# EAGLE design RasPi-BplusHAT (EAGLE 9.2.2)
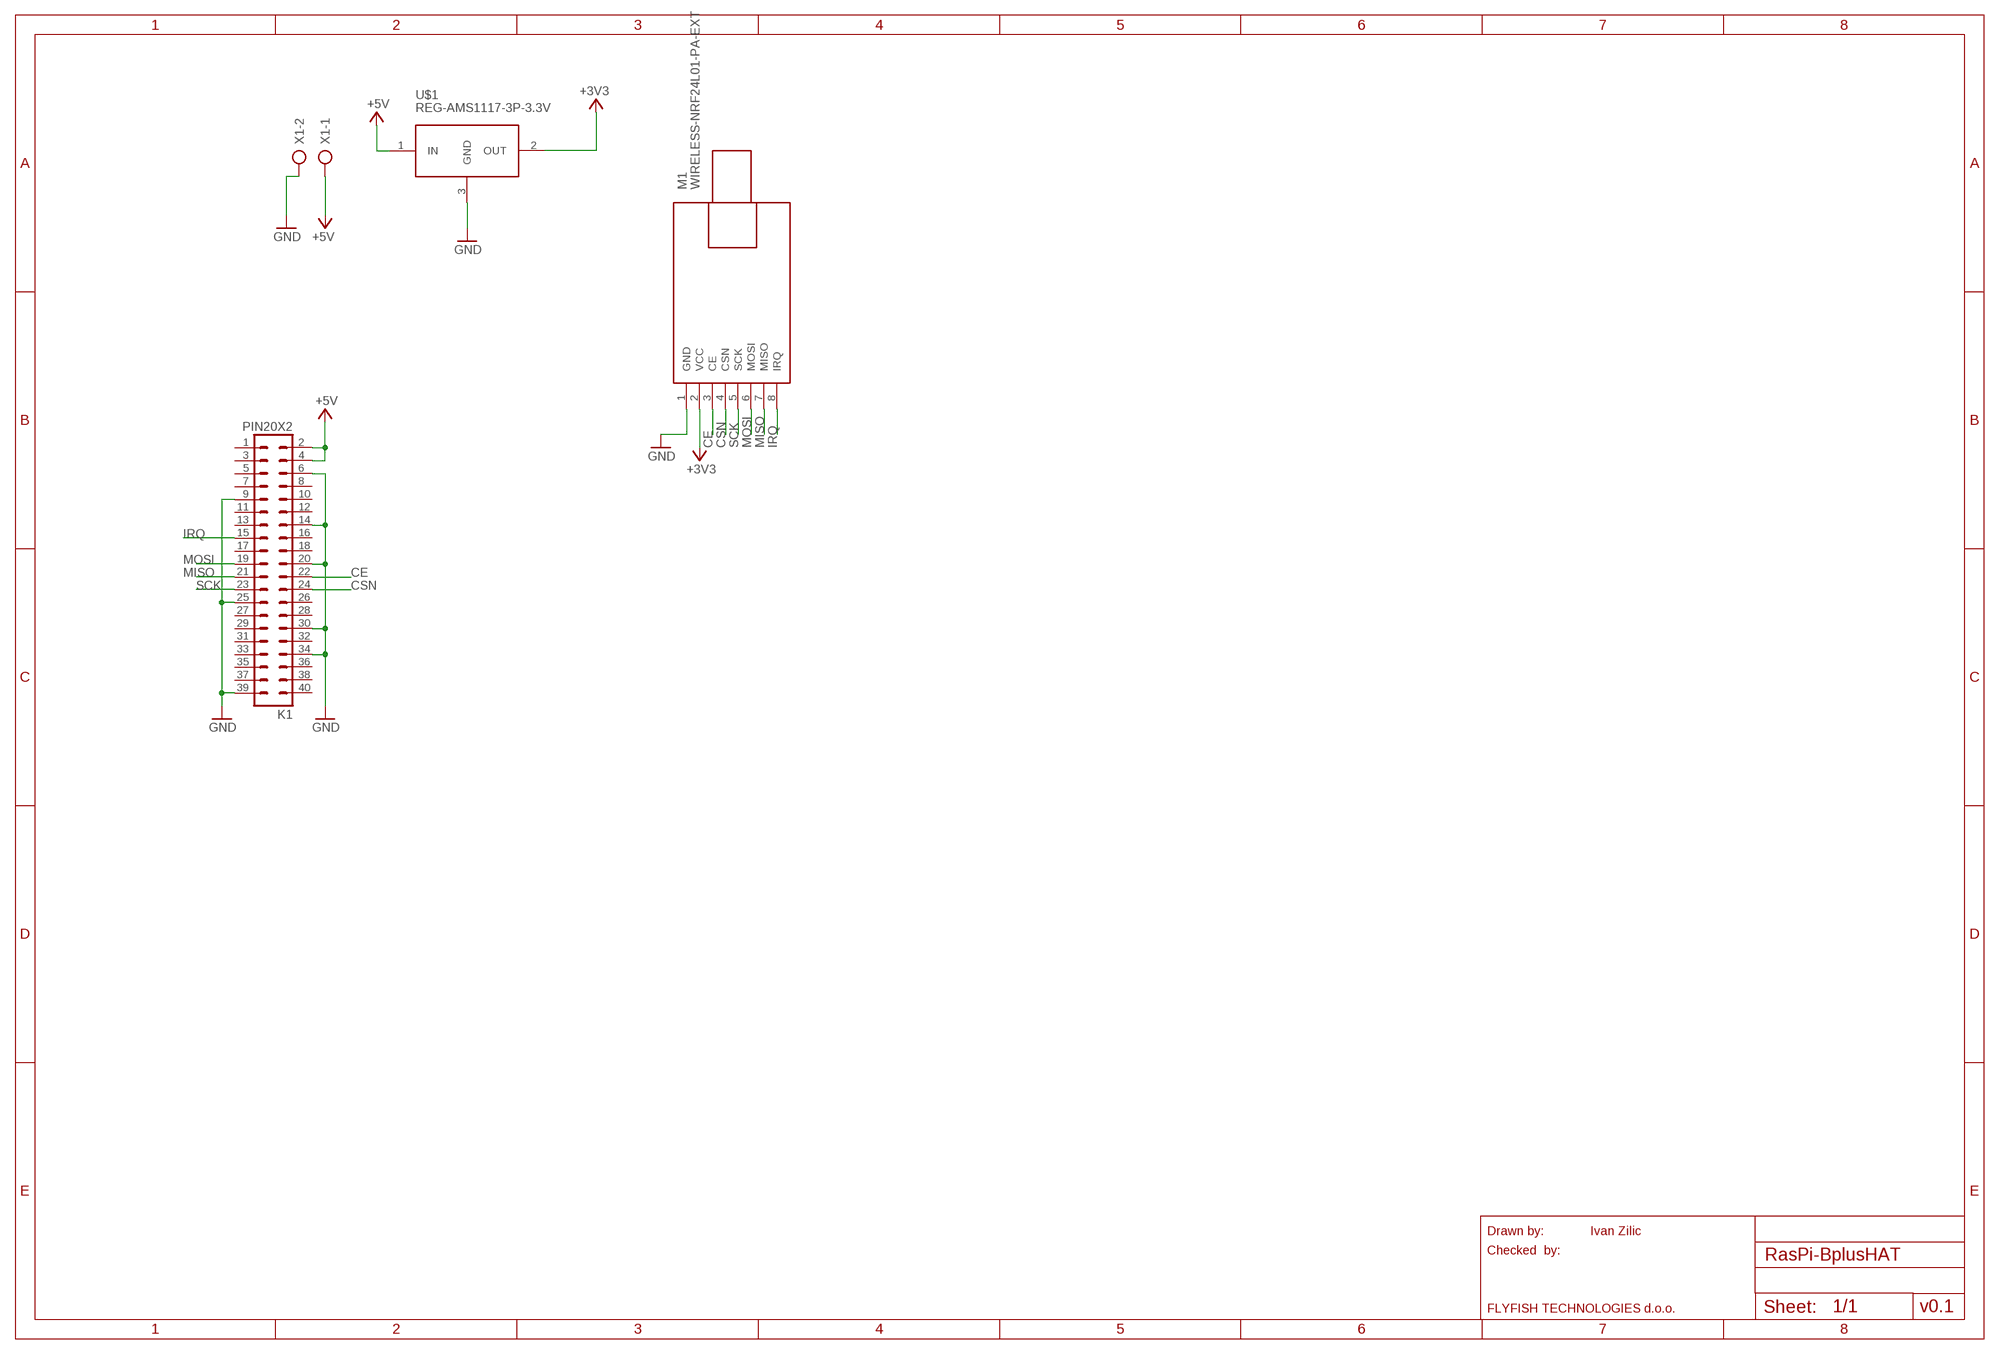
[diagram p0: schematic, sheet 1]

## Parts
K1  PIN20X2  [PIN_20X2]
M1  WIRELESS-NRF24L01-PA-EXT  [WIRELESS-NRF24L01-PA-EXT]
U$1  REG-AMS1117-3P-3.3V  [REG-AMS1117-3P]
X1  AK500/2  [AK500/2]

## Nets
+3V3: M1.2(VCC) U$1.2(OUT)
+5V: K1.2 K1.4 U$1.1(IN) X1.1
CE: K1.22 M1.3(CE)
CSN: K1.24 M1.4(CSN)
GND: K1.6 K1.9 K1.14 K1.20 K1.25 K1.30 K1.34 K1.39 M1.1(GND) U$1.3(GND) X1.2
IRQ: K1.15 M1.8(IRQ)
MISO: K1.21 M1.7(MISO)
MOSI: K1.19 M1.6(MOSI)
SCK: K1.23 M1.5(SCK)
Unconnected: K1.1 K1.3 K1.5 K1.7 K1.8 K1.10 K1.11 K1.12 K1.13 K1.16 K1.17 K1.18 K1.26 K1.27 K1.28 K1.29 K1.31 K1.32 K1.33 K1.35 K1.36 K1.37 K1.38 K1.40

## Notes on the sheet
- Drawn by: | Ivan Zilic
- Checked  by:
- FLYFISH TECHNOLOGIES d.o.o. | v0.1

## Library data of the parts
K1 = FLYFISH:PIN20X2
M1 = diy-modules (1):WIRELESS-NRF24L01-PA-EXT: 2.4 GHz Wireless Module based on NRF24L01 chip with preamplifier and external antenna Click here to find device on ebay.com <http://www.ebay.com/sch/nrf24l01+pa+lna+sma>
U$1 = diy-modules:REG-AMS1117-3P-*: Linear Regulator based on AMS1117 chip 3-pin version AMS1117 datasheet is available here: http://www.advanced-monolithic.com/pdf/ds1117.pdf Click here to find device on ebay.com <http://www.ebay.com/sch/ams1117+module> Note: There are many variants. Search for the proper version.
X1 = con-ptr500:AK500/2: CONNECTOR; OC_FARNELL: unknown; OC_NEWARK: unknown

## Board
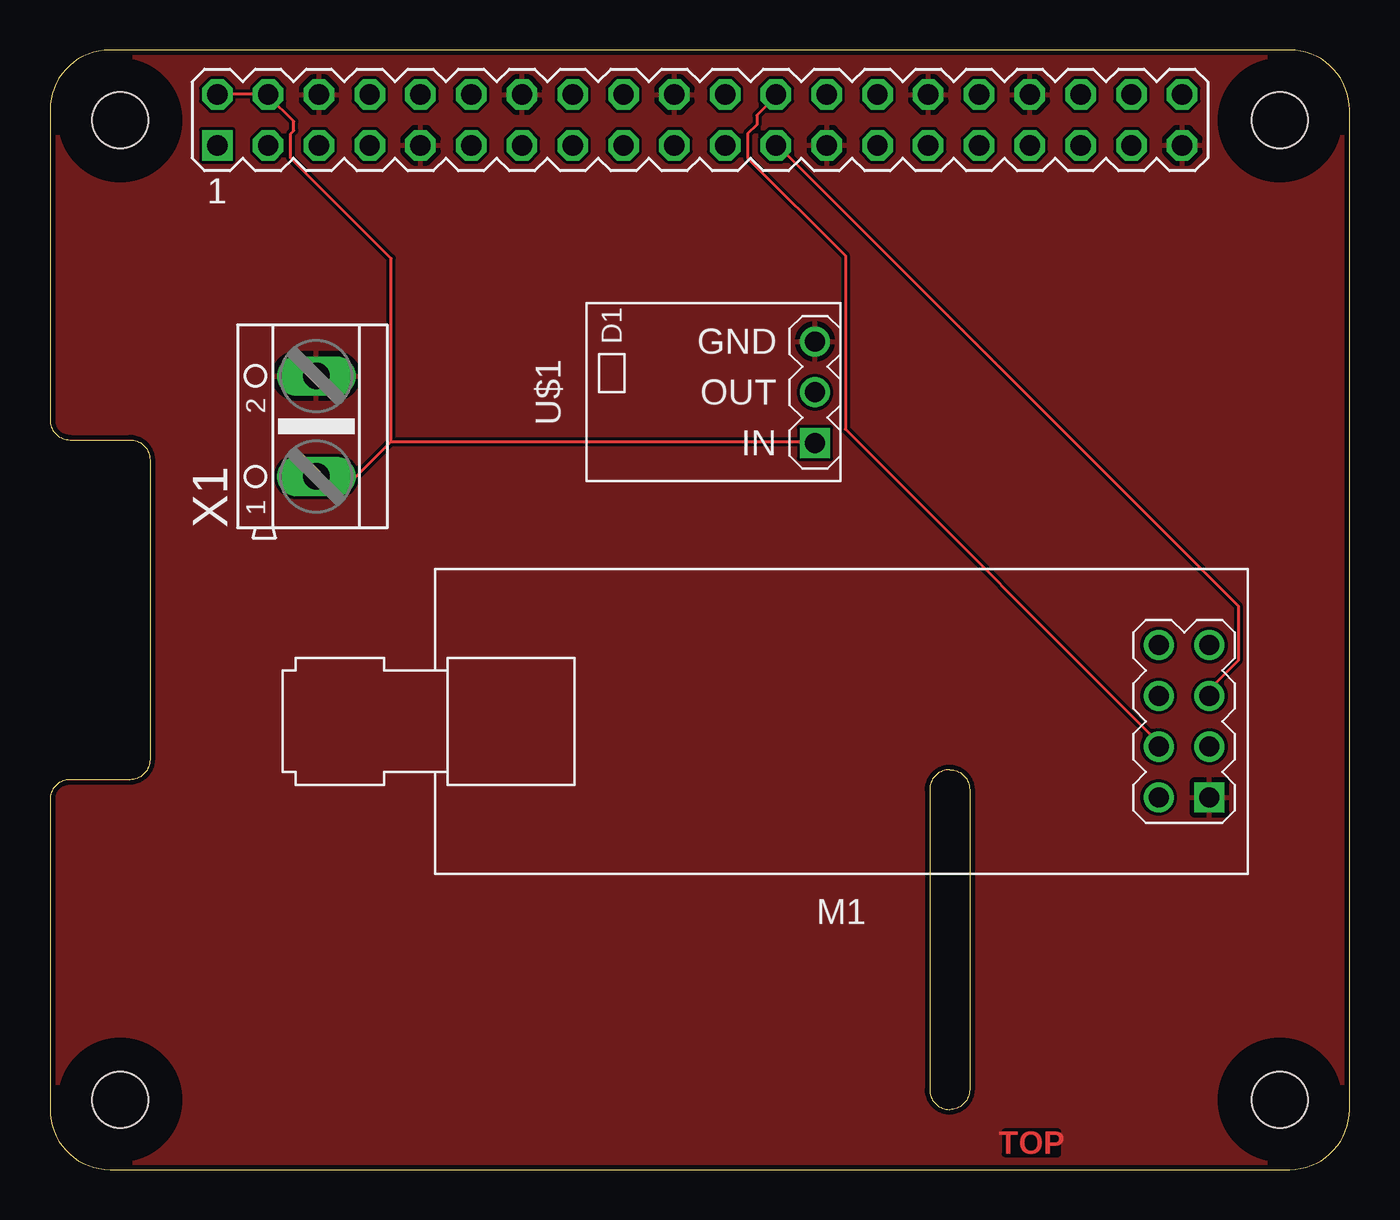
[diagram p1: board, top side]
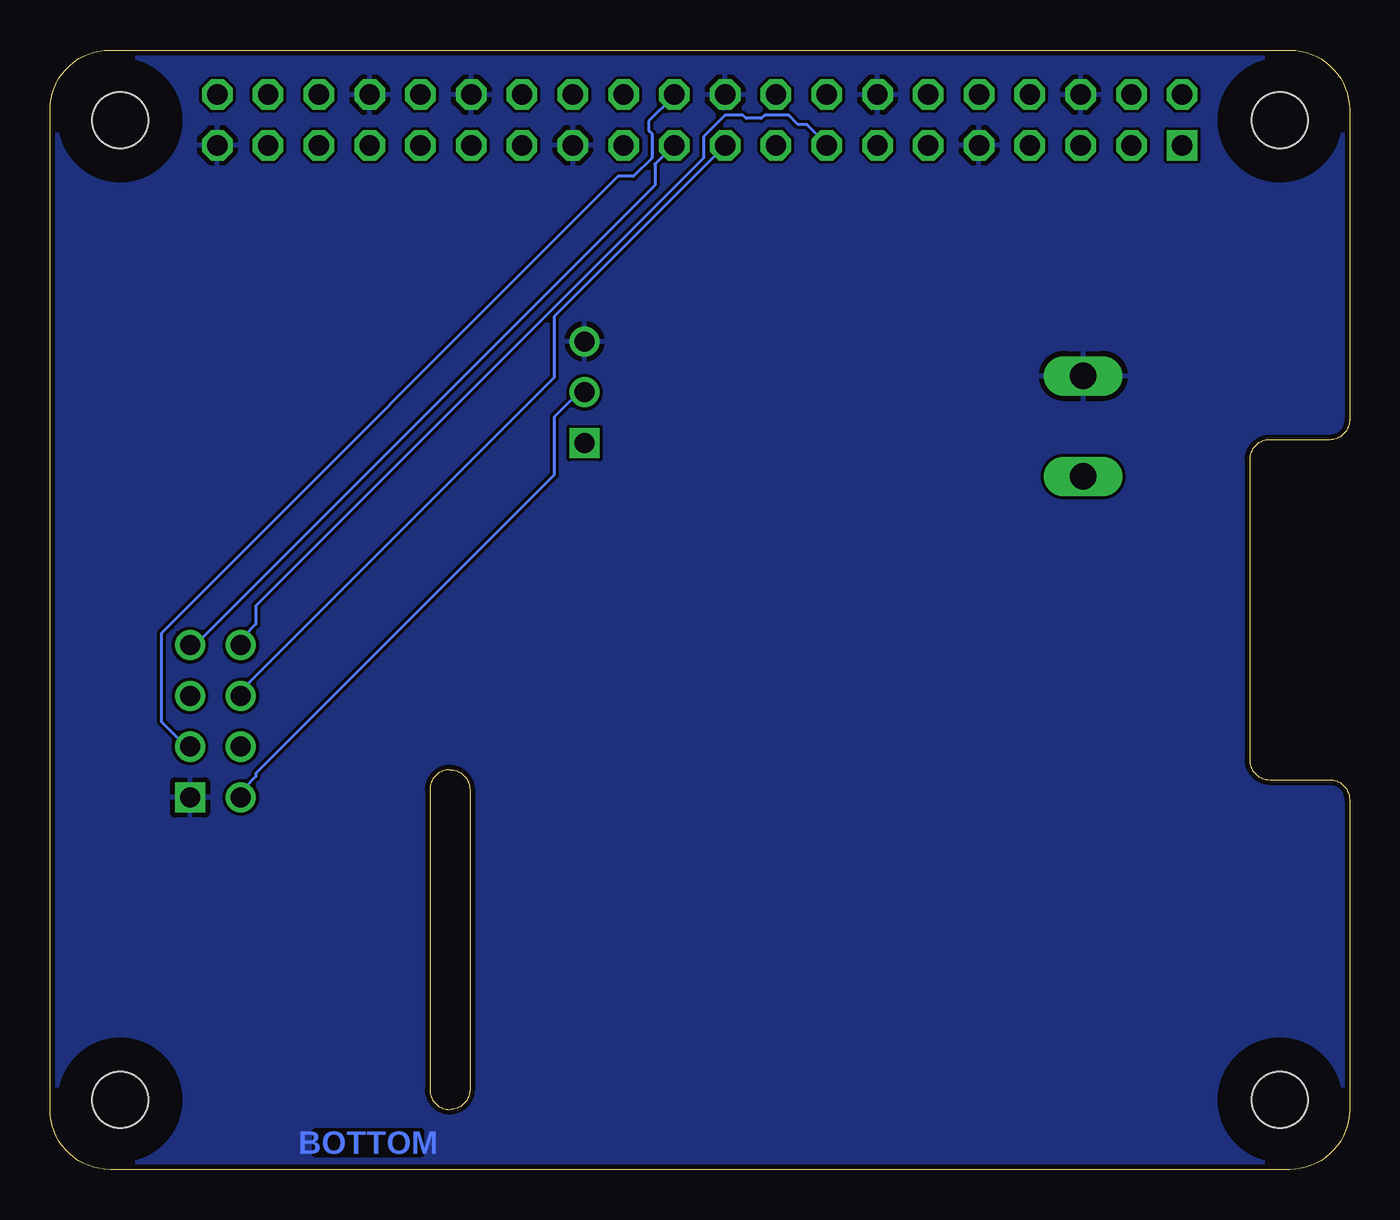
[diagram p2: board, bottom side, seen from below]

Size 65 x 56 mm. Coordinates in mm from the lower left corner, seen from the top.
Outline: 0,3 arc90 3,0 62,0 arc90 65,3 65,53 arc90 62,56 3,56 arc90 0,53 0,37.5 arc90 1,36.5 4,36.5 arc-90 5,35.5 5,20.5 arc-90 4,19.5 1,19.5 arc90 0,18.5 0,3
Outline: 44,19 44,4 arc90 45,3 arc90 46,4 46,19 arc90 45,20 arc90 44,19
Copper layers (1*16): Top 0.035mm / dielectric 1.5mm / Bottom 0.035mm
Design rules "ITEADstudio_DRC": minimum track width 6mil, minimum drill 12mil, track to track 6mil, track to pad 6mil, pad to pad 6mil, via to via 6mil, smd to smd 0mil, copper to edge 10mil, drill to drill 10mil, minimum pad ring 10mil, minimum via ring 6mil, stop-mask expansion 2mil, vias tented up to drill 100mil, thermal gap 10mil
Holes 2.8 mm at 3.5,3.5 3.5,52.5 61.5,52.5 61.5,3.5
tRestrict: area 1.9,51 to 5,54; area 60,51 to 63,54; area 60,1.9 to 63,5; area 1.9,1.9 to 5,5
bRestrict: area 1.9,1.9 to 5,5; area 1.9,51 to 5,54; area 60,1.9 to 63,5; area 60,51 to 63,54
Milling: 6 lines

### Footprints (pad centres in the part's own frame; a part is rotated, then mirrored left to right if it is on the bottom)
PIN_20X2 = drill 1.016 square: 1 -24.13,-1.27 | drill 1.016 octagon: 2 -24.13,1.27; 3 -21.59,-1.27; 4 -21.59,1.27; 5 -19.05,-1.27; 6 -19.05,1.27; 7 -16.51,-1.27; 8 -16.51,1.27; 9 -13.97,-1.27; 10 -13.97,1.27; 11 -11.43,-1.27; 12 -11.43,1.27; 13 -8.89,-1.27; 14 -8.89,1.27; 15 -6.35,-1.27; 16 -6.35,1.27; 17 -3.81,-1.27; 18 -3.81,1.27; 19 -1.27,-1.27; 20 -1.27,1.27; 21 1.27,-1.27; 22 1.27,1.27; 23 3.81,-1.27; 24 3.81,1.27; 25 6.35,-1.27; 26 6.35,1.27; 27 8.89,-1.27; 28 8.89,1.27; 29 11.43,-1.27; 30 11.43,1.27; 31 13.97,-1.27; 32 13.97,1.27; 33 16.51,-1.27; 34 16.51,1.27; 35 19.05,-1.27; 36 19.05,1.27; 37 21.59,-1.27; 38 21.59,1.27; 39 24.13,-1.27; 40 24.13,1.27
WIRELESS-NRF24L01-PA-EXT = drill 1 square: 1 -18.415,3.81 | drill 1: 2 -15.875,3.81; 3 -18.415,1.27; 4 -15.875,1.27; 5 -18.415,-1.27; 6 -15.875,-1.27; 7 -18.415,-3.81; 8 -15.875,-3.81
REG-AMS1117-3P = drill 1 square: 1 -2.54,-5.08 | drill 1: 2 0,-5.08; 3 2.54,-5.08
AK500/2 = drill 1.321 long: 1 -2.515,0; 2 2.515,0

### Placement (x,y rotation side)
K1  32.5,52.5 0 top
M1  39.58,22.42 180 top
U$1  33.18,38.88 90 top
X1  13.32,37.18 90 top

### Tracks (layer width: path | path; a pad name or v marks a point on that pad's centre or on a via)
+3V3
  Bottom 0.152: M1.2 55.32,18.75 55.32,19.05 54.71,19.66 54.71,19.81 39.78,34.75 39.78,37.64 38.41,39.01 U$1.2
+5V
  Top 0.152: K1.2 8.38,53.8 10.82,53.8 K1.4 10.97,53.65 12.19,52.43 12.19,51.97 12.04,51.82 12.04,50.6 17.07,45.57 17.07,36.42 | 17.07,36.42 38.25,36.42 U$1.1 | 17.07,36.42 15.24,34.59 13.41,34.59 X1.1
CE
  Bottom 0.152: M1.3 58.06,21.18 58.37,21.49 58.52,21.49 59.44,22.4 59.44,26.82 36.58,49.68 35.81,49.68 34.9,50.6 34.9,51.82 35.05,51.97 35.05,52.43 33.83,53.65 K1.22
CSN
  Top 0.152: M1.4 55.32,21.18 55.32,21.49 39.78,37.03 39.78,45.72 34.9,50.6 34.9,51.82 35.36,52.27 35.36,52.73 36.27,53.65 K1.24
GND
  pour Bottom: 0,3 arc90 3,0 62,0 arc90 65,3 65,53 arc90 62,56 3,56 arc90 0,53 0,37.5 arc90 1,36.5 4,36.5 arc-90 5,35.5 5,20.5 arc-90 4,19.5 1,19.5 arc90 0,18.5
  pour Top: 0,3 arc90 3,0 62,0 arc90 65,3 65,53 arc90 62,56 3,56 arc90 0,53 0,37.5 arc90 1,36.5 4,36.5 arc-90 5,35.5 5,20.5 arc-90 4,19.5 1,19.5 arc90 0,18.5
IRQ
  Bottom 0.152: M1.8 55.32,26.36 55.32,26.67 54.71,27.28 54.71,28.19 32.31,50.6 32.31,51.66 31.24,52.73 30.33,52.73 30.18,52.58 29.41,52.58 29.26,52.73 28.04,52.73 27.58,52.27 27.13,52.27 26.21,51.36 K1.15
MISO
  Bottom 0.152: M1.7 57.91,26.36 57.61,26.36 34.75,49.23 34.75,50.29 33.83,51.21 K1.21
MOSI
  Bottom 0.152: M1.6 55.32,23.77 55.32,24.08 39.78,39.62 39.78,42.67 31.24,51.21 K1.19
SCK
  Top 0.152: M1.5 58.06,23.77 58.06,24.08 59.44,25.45 59.44,28.19 36.42,51.21 K1.23

### Text on the board
Top: TOP
Bottom: BOTTOM